# EAGLE schematic 4 key with encoder (EAGLE 9.6.2)
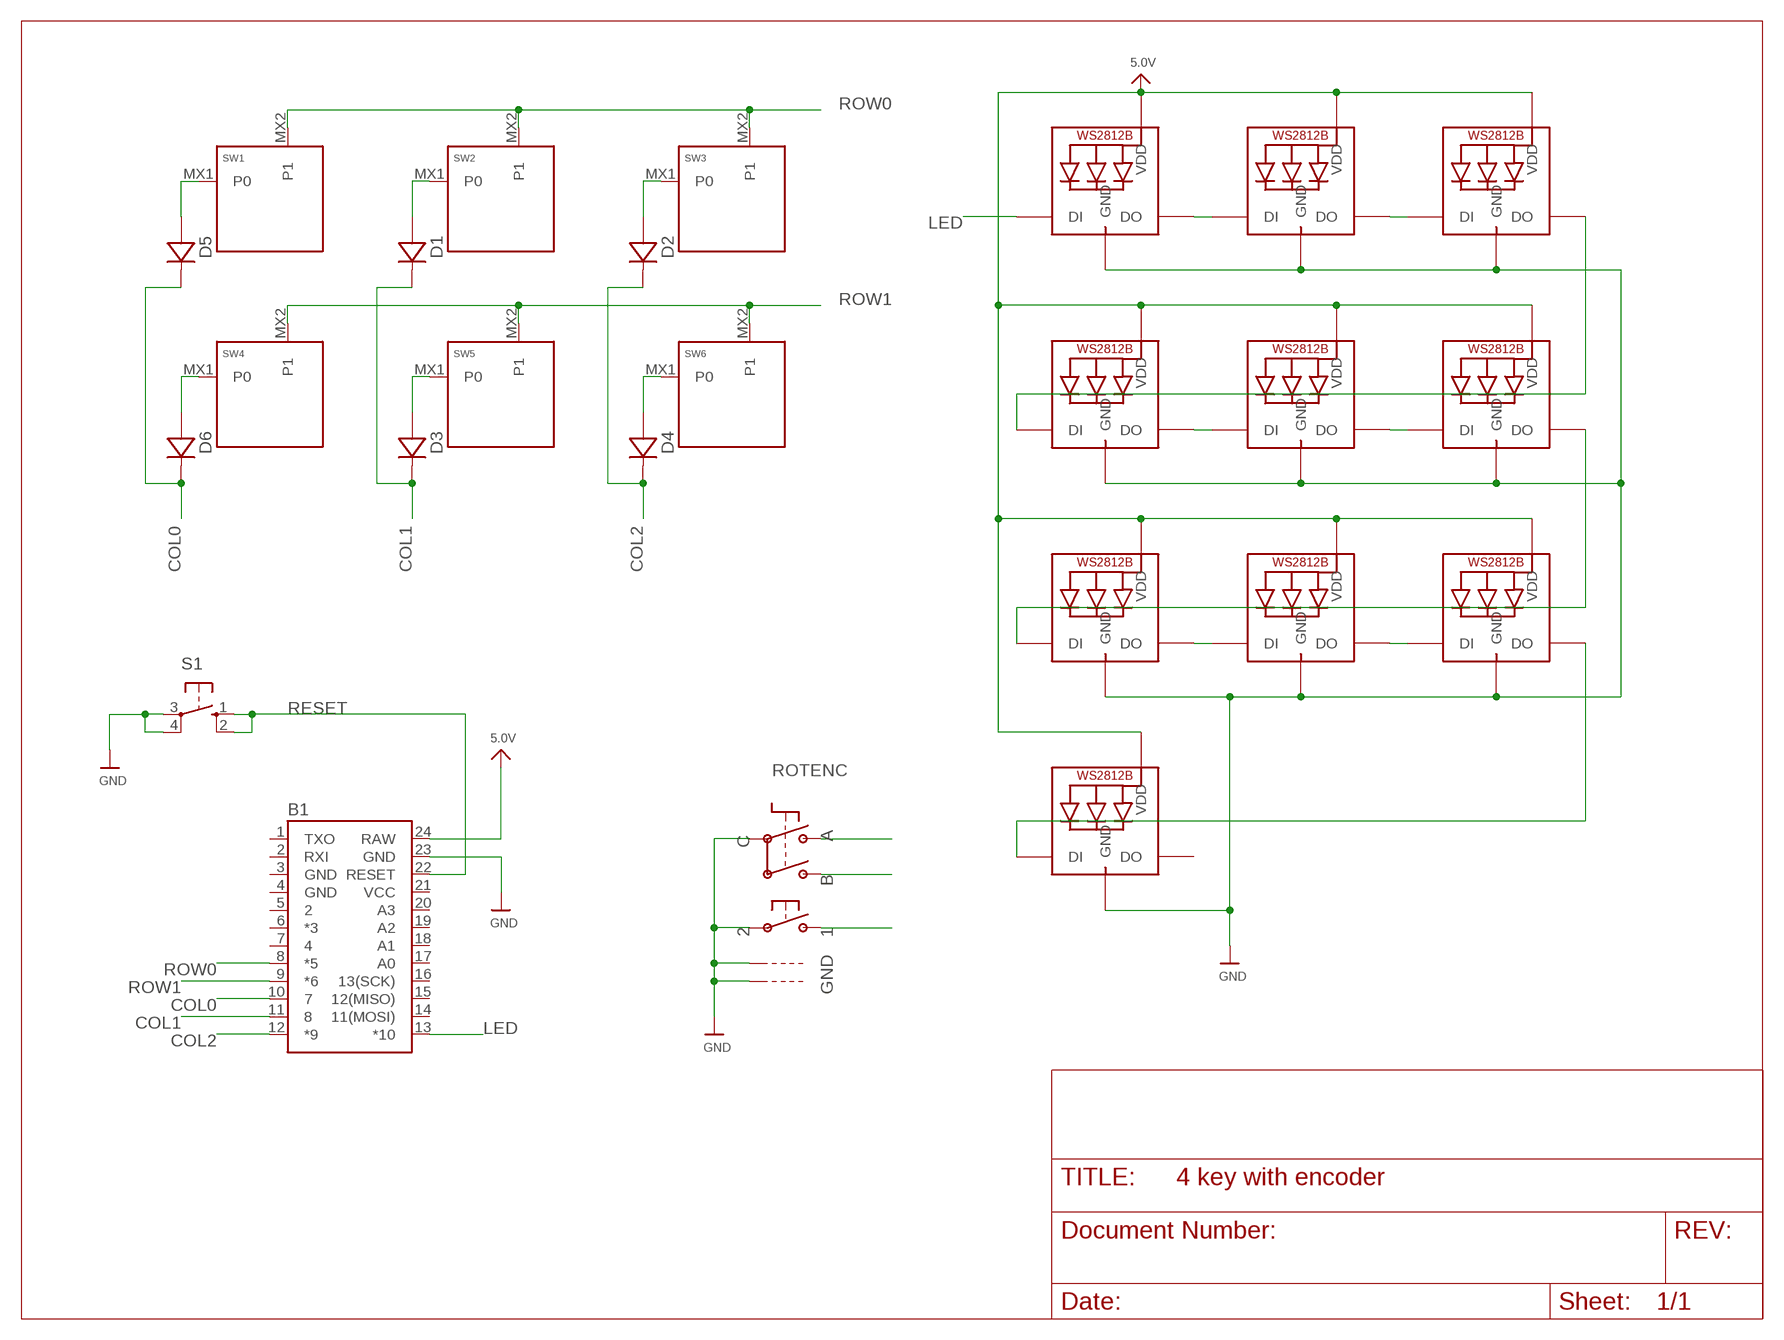
[diagram p0: schematic, sheet 1]

## Parts
B1  SPARKFUN_PRO_MICRO  [SPARKFUN_PRO_MICRO]
D1  DIODE-SOD-123  [SOD-123]
D2  DIODE-SOD-123  [SOD-123]
D3  DIODE-SOD-123  [SOD-123]
D4  DIODE-SOD-123  [SOD-123]
D5  DIODE-SOD-123  [SOD-123]
D6  DIODE-SOD-123  [SOD-123]
LED1  WS2812B_SK6812E  [NEO3535_REVERSE]
LED2  WS2812B_SK6812E  [NEO3535_REVERSE]
LED3  WS2812B_SK6812E  [NEO3535_REVERSE]
LED4  WS2812B_SK6812E  [NEO3535_REVERSE]
LED5  WS2812B_SK6812E  [NEO3535_REVERSE]
LED6  WS2812B_SK6812E  [NEO3535_REVERSE]
LED7  WS2812B_SK6812E  [NEO3535_REVERSE]
LED8  WS2812B_SK6812E  [NEO3535_REVERSE]
LED9  WS2812B_SK6812E  [NEO3535_REVERSE]
LED10  WS2812B_SK6812E  [NEO3535_REVERSE]
ROTENC  ENCODER_PLUS_SWITCH_BOURNS_PEC11  [PEC11+SWITCH]
S1  10-XX  [B3F-10XX]
SW1  KEYSWITCH-PLAIN-MXHS-1U  [MXHS-1U]
SW2  KEYSWITCH-PLAIN-MXHS-1U  [MXHS-1U]
SW3  KEYSWITCH-PLAIN-MXHS-1U  [MXHS-1U]
SW4  KEYSWITCH-PLAIN-MXHS-1U  [MXHS-1U]
SW5  KEYSWITCH-PLAIN-MXHS-1U  [MXHS-1U]
SW6  KEYSWITCH-PLAIN-MXHS-1U  [MXHS-1U]

## Nets
5.0V: B1.24(RAW) LED1.1-VDD(VDD) LED2.1-VDD(VDD) LED3.1-VDD(VDD) LED4.1-VDD(VDD) LED5.1-VDD(VDD) LED6.1-VDD(VDD) LED7.1-VDD(VDD) LED8.1-VDD(VDD) LED9.1-VDD(VDD) LED10.1-VDD(VDD)
COL0: B1.10 D5.C D6.C
COL1: B1.11 D1.C D3.C
COL2: B1.12(*9) D2.C D4.C
GND: B1.23(GND) LED1.3-GND(GND) LED2.3-GND(GND) LED3.3-GND(GND) LED4.3-GND(GND) LED5.3-GND(GND) LED6.3-GND(GND) LED7.3-GND(GND) LED8.3-GND(GND) LED9.3-GND(GND) LED10.3-GND(GND) ROTENC.P$2 ROTENC.P$C ROTENC.P$GND1 ROTENC.P$GND2 S1.3(P) S1.4(P1)
LED: B1.13(*10) LED1.4-DIN(DI)
N$1: D5.A SW1.MX1(P0)
N$2: D6.A SW4.MX1(P0)
N$3: D3.A SW5.MX1(P0)
N$4: D1.A SW2.MX1(P0)
N$5: D2.A SW3.MX1(P0)
N$6: D4.A SW6.MX1(P0)
N$8: LED1.2-DOUT(DO) LED2.4-DIN(DI)
N$11: LED2.2-DOUT(DO) LED3.4-DIN(DI)
N$12: LED3.2-DOUT(DO) LED4.4-DIN(DI)
N$13: LED4.2-DOUT(DO) LED5.4-DIN(DI)
N$14: LED5.2-DOUT(DO) LED6.4-DIN(DI)
N$15: LED6.2-DOUT(DO) LED7.4-DIN(DI)
N$16: LED7.2-DOUT(DO) LED8.4-DIN(DI)
N$17: LED8.2-DOUT(DO) LED9.4-DIN(DI)
N$18: LED9.2-DOUT(DO) LED10.4-DIN(DI)
N$24: ROTENC.P$A
N$25: ROTENC.P$B
N$26: ROTENC.P$1
RESET: B1.22(RESET) S1.1(S) S1.2(S1)
ROW0: B1.8(*5) SW1.MX2(P1) SW2.MX2(P1) SW3.MX2(P1)
ROW1: B1.9(*6) SW4.MX2(P1) SW5.MX2(P1) SW6.MX2(P1)
Unconnected: B1.1(TXO) B1.2(RXI) B1.5 B1.6(*3) B1.7 B1.14(11(MOSI)) B1.15(12(MISO)) B1.16(13(SCK)) B1.17(A0) B1.18(A1) B1.19(A2) B1.20(A3) LED10.2-DOUT(DO)

## Power pins joined to a net without a drawn wire
GND: B1.3(GND) B1.4(GND)
VCC: B1.21(VCC)

## Library data of the parts
B1 = keeb-library:SPARKFUN_PRO_MICRO: SparkFun Pro Micro Atmega32U4 compatible footprint. SparkFun Products: 3.3V/8MHz <https://www.sparkfun.com/products/12587> 5V/16MHz <https://www.sparkfun.com/products/12640>
D1-D6 = keeb-library:DIODE: Standard 1N4148 diode
LED1-LED10 = keeb-library:WS2812B
ROTENC = keeb-library:ENCODER_PLUS_SWITCH: Rotary Encoder with Built-In Switch PEC11 - 24 Step, PEC11-4215F-S24 - http://www.adafruit.com/products/377
S1 = keeb-library:10-XX: OMRON SWITCH; MPN: B3F-1000; OC_FARNELL: 176432; OC_NEWARK: 36M3542
SW1-SW6 = keeb-library:KEYSWITCH-PLAIN